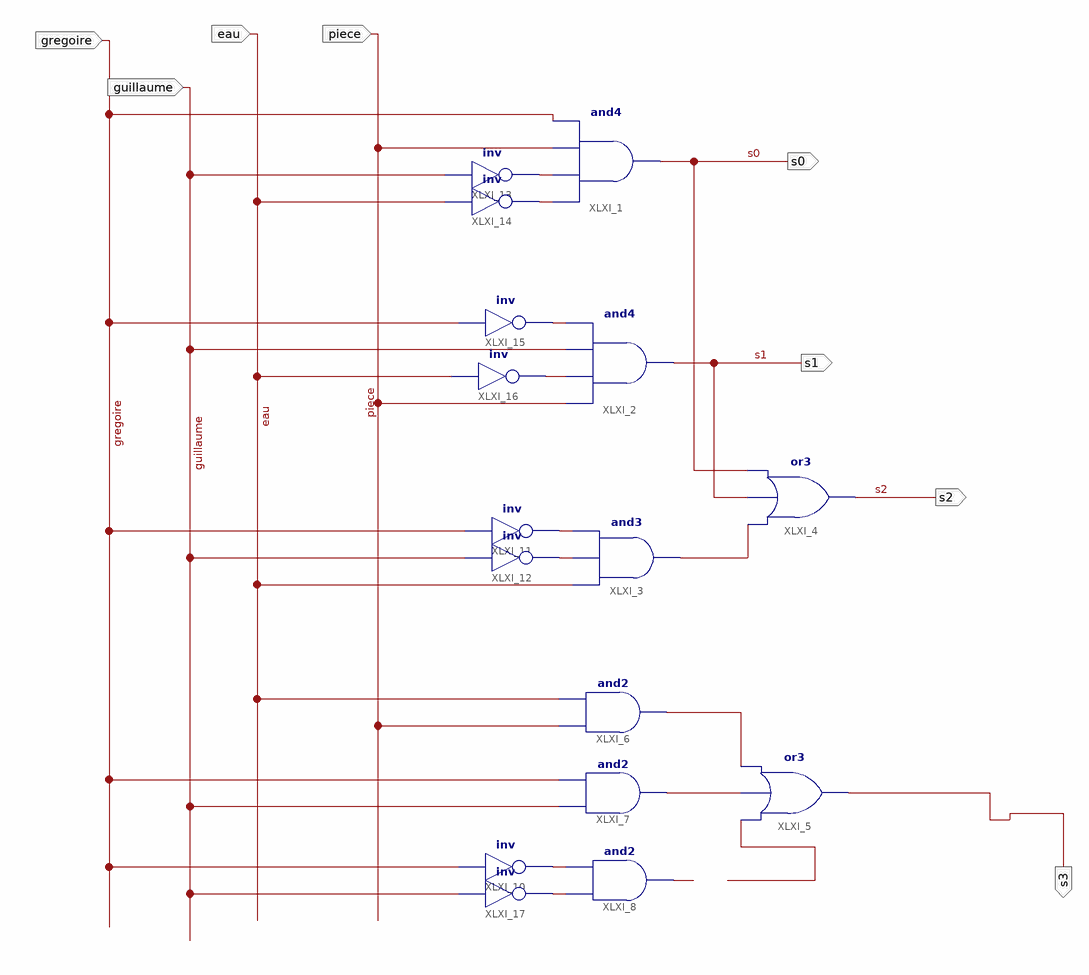
[diagram p0: schematic sheet 1]
// Xilinx ISE schematic toplevel.sch (spartan3e) as structural Verilog: 16 symbols, 8 ports
module toplevel (
  input  guillaume,
  input  piece,
  input  eau,
  input  gregoire,
  output s0,
  output s1,
  output s2,
  output s3
);

  wire XLXN_5, XLXN_6, XLXN_7, XLXN_8, XLXN_9, XLXN_10, XLXN_14, XLXN_19, XLXN_21, XLXN_22, XLXN_24, XLXN_33,
       XLXN_34;

  and XLXI_1 (s0, XLXN_9, XLXN_8, piece, gregoire);
  and XLXI_2 (s1, piece, XLXN_10, guillaume, XLXN_14);
  and XLXI_3 (XLXN_19, eau, XLXN_7, XLXN_6);
  or XLXI_4 (s2, XLXN_19, s1, s0);
  or XLXI_5 (s3, XLXN_34, XLXN_22, XLXN_21);
  and XLXI_6 (XLXN_21, piece, eau);
  and XLXI_7 (XLXN_22, guillaume, gregoire);
  and XLXI_8 (XLXN_33, XLXN_24, XLXN_5);
  not XLXI_10 (XLXN_5, gregoire);
  not XLXI_11 (XLXN_6, gregoire);
  not XLXI_12 (XLXN_7, guillaume);
  not XLXI_13 (XLXN_8, guillaume);
  not XLXI_15 (XLXN_14, gregoire);
  not XLXI_16 (XLXN_10, eau);
  not XLXI_14 (XLXN_9, eau);
  not XLXI_17 (XLXN_24, guillaume);
endmodule
